# Altium schematic sheet Power Supply.SchDoc
size A4; SheetNumber: 10; SheetTotal: 13
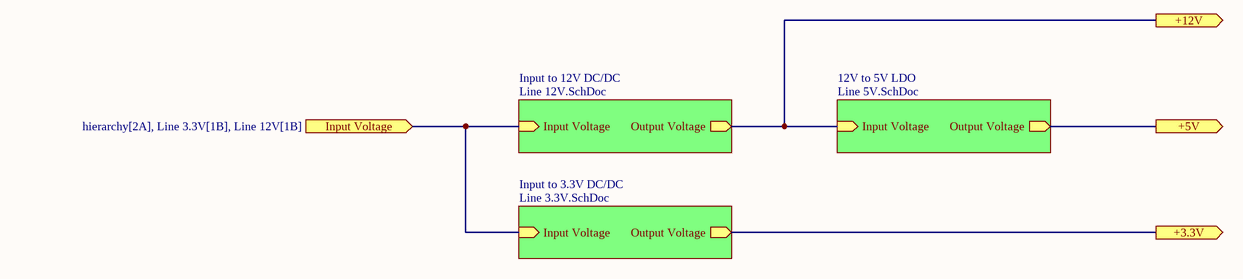
[diagram p0: Power Supply.SchDoc]

## Sub-sheets
12V to 5V LDO = Line 5V.SchDoc: Input Voltage (in), Output Voltage (out)
Input to 3.3V DC/DC = Line 3.3V.SchDoc: Input Voltage (in), Output Voltage (out)
Input to 12V DC/DC = Line 12V.SchDoc: Input Voltage (in), Output Voltage (out)

## Ports
+3.3V (out), +5V (out), +12V (out), Input Voltage (in, see hierarchy[2A], Line 3.3V[1B], Line 12V[1B])

## Nets
+3.3V: port +3.3V, sheet Input to 3.3V DC/DC/Output Voltage
+5V: port +5V, sheet 12V to 5V LDO/Output Voltage
+12V: port +12V, sheet Input to 12V DC/DC/Output Voltage, sheet 12V to 5V LDO/Input Voltage
Input Voltage: port Input Voltage, sheet Input to 3.3V DC/DC/Input Voltage, sheet Input to 12V DC/DC/Input Voltage